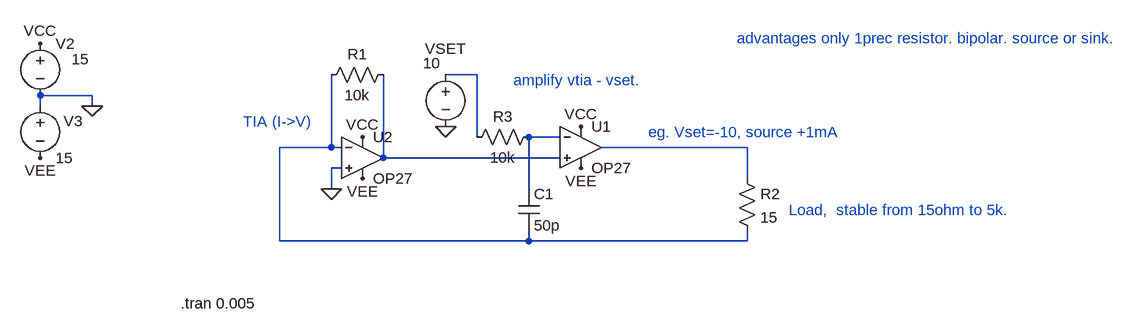
[diagram p0: schematic Draft20asc.asc]
Draft20asc.asc, the LTspice schematic file:
Version 4
SHEET 1 1620 680
WIRE 592 -32 544 -32
WIRE 0 0 -80 0
WIRE -80 16 -80 0
WIRE 0 16 0 0
WIRE 592 64 592 -32
WIRE 720 64 672 64
WIRE 368 80 368 -32
WIRE 368 80 288 80
WIRE 384 80 368 80
WIRE 1008 80 784 80
WIRE 448 96 448 -32
WIRE 720 96 448 96
WIRE 384 112 368 112
WIRE 1008 128 1008 80
WIRE 368 144 368 112
WIRE 672 144 672 64
WIRE 288 224 288 80
WIRE 672 224 672 208
WIRE 672 224 288 224
WIRE 1008 224 1008 208
WIRE 1008 224 672 224
FLAG 544 48 0
FLAG 0 16 0
FLAG -80 -80 VCC
FLAG 416 64 VCC
FLAG -80 96 VEE
FLAG 416 128 VEE
FLAG 752 48 VCC
FLAG 752 112 VEE
FLAG 368 144 0
SYMBOL voltage 544 -48 R0
WINDOW 123 0 0 Left 0
WINDOW 39 0 0 Left 0
WINDOW 3 -35 -2 Left 2
WINDOW 0 -32 -24 Left 2
SYMATTR Value 10
SYMATTR InstName VSET
SYMBOL voltage -80 -96 R0
WINDOW 123 0 0 Left 0
WINDOW 39 0 0 Left 0
WINDOW 3 48 40 Left 2
SYMATTR Value 15
SYMATTR InstName V2
SYMBOL voltage -80 0 R0
WINDOW 123 0 0 Left 0
WINDOW 39 0 0 Left 0
WINDOW 0 36 39 Left 2
SYMATTR InstName V3
SYMATTR Value 15
SYMBOL res 464 -48 R90
WINDOW 0 0 56 VBottom 2
WINDOW 3 32 56 VTop 2
SYMATTR InstName R1
SYMATTR Value 10k
SYMBOL res 992 112 R0
SYMATTR InstName R2
SYMATTR Value 15
SYMBOL OpAmps\\OP27 752 16 R0
SYMATTR InstName U1
SYMBOL OpAmps\\OP27 416 32 R0
SYMATTR InstName U2
SYMBOL res 688 48 R90
WINDOW 0 0 56 VBottom 2
WINDOW 3 32 56 VTop 2
SYMATTR InstName R3
SYMATTR Value 10k
SYMBOL cap 656 144 R0
SYMATTR InstName C1
SYMATTR Value 50p
TEXT 136 320 Left 2 !.tran 0.005
TEXT 856 56 Left 2 ;eg. Vset=-10, source +1mA
TEXT 232 40 Left 2 ;TIA (I->V)
TEXT 1072 176 Left 2 ;Load,  stable from 15ohm to 5k.
TEXT 648 -24 Left 2 ;amplify vtia - vset.
TEXT 992 -88 Left 2 ;advantages only 1prec resistor. bipolar. source or sink.

The netlist it stands for:
* Draft20asc.asc
VSET N001 0 10
V2 VCC 0 15
V3 0 VEE 15
R1 N005 N003 10k
R2 N004 N003 15
XU1 N005 N002 VCC VEE N004 OP27  ; pins In+ In- V+ V- OUT
XU2 0 N003 VCC VEE N005 OP27  ; pins In+ In- V+ V- OUT
R3 N002 N001 10k
C1 N002 N003 50p
.tran 0.005
* eg. Vset=-10, source +1mA
* TIA (I->V)
* Load,  stable from 15ohm to 5k.
* amplify vtia - vset.
* advantages only 1prec resistor. bipolar. source or sink.
.lib ADI.lib
.backanno
.end